# Altium schematic sheet MCU.SchDoc: MCU
size A; Revision: 2.0; SheetNumber: 2; SheetTotal: 3
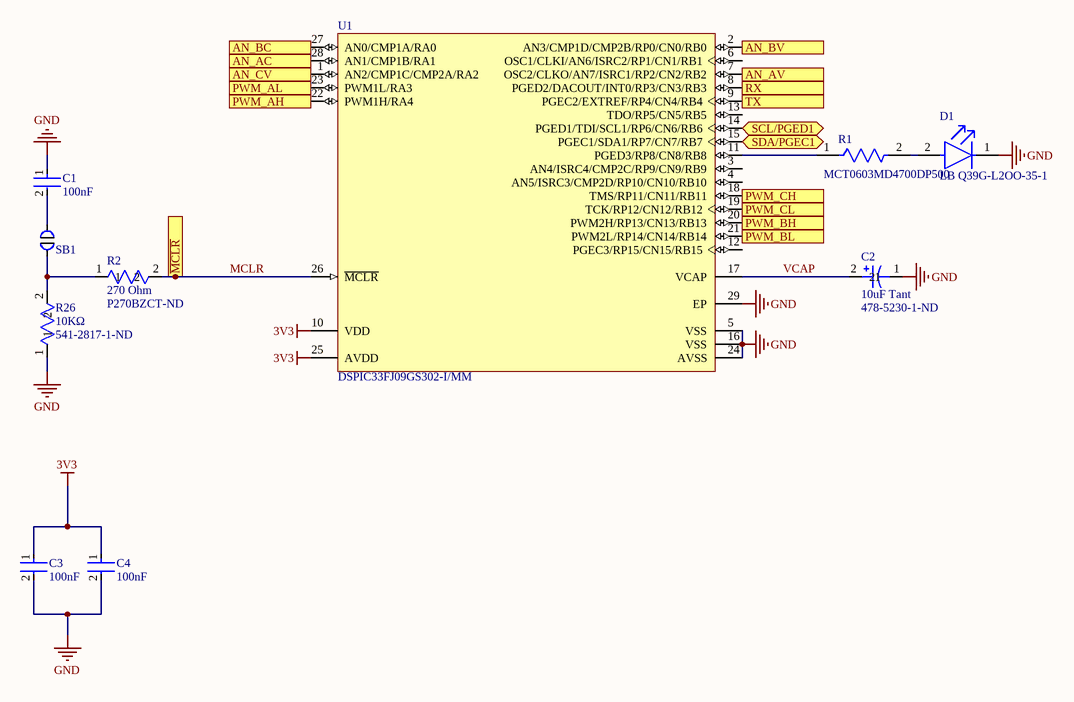
[diagram p0: MCU.SchDoc]

## Parts
C1  100nF  [FP-CL10-IPC_C]
C2  10uF Tant  Supplier Part Number 1: 478-5230-1-ND  [TPSB106K016R0500]
C3  100nF  [FP-CL10-IPC_C]
C4  100nF  [FP-CL10-IPC_C]
D1  LB Q39G-L2OO-35-1  [FP-LB_Q39G-MFG]
R1  MCT0603MD4700DP500  [FP-MCT0603-IPC_A]
R2  270 Ohm  Supplier Part Number 1: P270BZCT-ND  [ERJ-PA3J271V]
R26  10KΩ  Supplier Part Number 1: 541-2817-1-ND  [RCS060310K0JNEA]
SB1  Solder Bridge Open  [Solder Bridge Open]  (value not drawn)
U1  DSPIC33FJ09GS302-I/MM  [MCHP-QFN-S-MM28_M]

## Ports
AN_AC (in), AN_AV (in), AN_BC (in), AN_BV (in), AN_CV (in), PWM_AH (out), PWM_AL (out), PWM_BH (out), PWM_BL (out), PWM_CH (out), PWM_CL (out), RX (in), SCL/PGED1 (bidir), SDA/PGEC1 (bidir), TX (out), ~{MCLR} (in)

## Nets
3V3: C3.1 C4.1 U1.10(VDD) U1.25(AVDD)
GND: C1.1 C2.1 C3.2 C4.2 D1.1(C) R26.1 U1.5(VSS) U1.16(VSS) U1.24(AVSS) U1.29(EP)
AN_AC: U1.28(AN1/CMP1B/RA1) ; port AN_AC
AN_AV: U1.7(OSC2/CLKO/AN7/ISRC1/RP2/CN2/RB2) ; port AN_AV
AN_BC: U1.27(AN0/CMP1A/RA0) ; port AN_BC
AN_BV: U1.2(AN3/CMP1D/CMP2B/RP0/CN0/RB0) ; port AN_BV
AN_CV: U1.1(AN2/CMP1C/CMP2A/RA2) ; port AN_CV
MCLR: R2.2 U1.26(~{MCLR}) ; port ~{MCLR}
PWM_AH: U1.22(PWM1H/RA4) ; port PWM_AH
PWM_AL: U1.23(PWM1L/RA3) ; port PWM_AL
PWM_BH: U1.20(PWM2H/RP13/CN13/RB13) ; port PWM_BH
PWM_BL: U1.21(PWM2L/RP14/CN14/RB14) ; port PWM_BL
PWM_CH: U1.18(TMS/RP11/CN11/RB11) ; port PWM_CH
PWM_CL: U1.19(TCK/RP12/CN12/RB12) ; port PWM_CL
RX: U1.8(PGED2/DACOUT/INT0/RP3/CN3/RB3) ; port RX
SCL/PGED1: U1.14(PGED1/TDI/SCL1/RP6/CN6/RB6) ; port SCL/PGED1
SDA/PGEC1: U1.15(PGEC1/SDA1/RP7/CN7/RB7) ; port SDA/PGEC1
TX: U1.9(PGEC2/EXTREF/RP4/CN4/RB4) ; port TX
VCAP: C2.2 U1.17(VCAP)
NetC1_2: C1.2 SB1.1
NetD1_2: D1.2(A) R1.2
NetR1_1: R1.1 U1.11(PGED3/RP8/CN8/RB8)
NetR2_1: R2.1 R26.2 SB1.2

Not connected (* = marked no-connect by the designer): U1 3(AN4/ISRC4/CMP2C/RP9/CN9/RB9) 4(AN5/ISRC3/CMP2D/RP10/CN10/RB10) 6(OSC1/CLKI/AN6/ISRC2/RP1/CN1/RB1) 12(PGEC3/RP15/CN15/RB15) 13(TDO/RP5/CN5/RB5)

## Notes on the sheet
- Title
- Size:
- Date:
- A
- Number:
- Time:
- Revision:
- Sheet
- of
- File:

## Library data of the parts
C1 C3 C4 = CMP-13271-001724-1: Cap Ceramic 100nF 50V X7R ±20% Pad SMD 0603 +125°C T/R; Mount: Surface Mount; Lead Free: Lead Free; Max Operating Temperature: 125°C; Voltage Rating: 50V; Case Code (Imperial): 0603; Capacitance: 100nF; Height: 0.8mm; Length: 1.6mm; Tolerance: 20%; Case Code (Metric): 1608; Thickness: 0.035inch; Depth: 0.8mm; Width: 0.031inch; Package Quantity: 1; Min Operating Temperature: -55°C; Case/Package: 0603; Radiation Hardening: No; Voltage Rating (DC): 50V; Dielectric: X7R; Packaging: Tape and Reel
C2 = TPSB106K016R0500: CAP TANT 10UF 10% 16V SMD; Manufacturer: Kyocera AVX; Dielectric Material: Tantalum; ESR (Equivalent Series Resistance): 500mR; Leakage Current: 1.6uA; Polarity: Polar; Dissipation Factor: 6%; Supplier 1: Digi-Key; Manufacturer Part Number: TPSB106K016R0500; RoHS: Yes; Category: Tantalum Capacitors; Stock 1: 4; Pricing 1: 1=0.45000, 10=0.31900, 50=0.24140, 100=0.21030, 500=0.15580, 1000=0.13243 (USD); Mount: Surface Mount,PCB; Case/Package: 1210; Case Code (Metric): 3528; Case Code (Imperial): 1210; Min Operating Temperature: -55°C; Max Operating Temperature: 125°C; Capacitance: 10uF; Tolerance: 10%; Packaging: Tape and Reel; Package Quantity: 1; Voltage Rating: 16V; Voltage Rating (DC): 16V; Features: General Purpose; Termination: SMD/SMT; Voltage: 16V; Length: 3.5mm; Width: 0.11inch; Height: 1.9mm; Depth: 2.8mm; Height - Seated (Max): 0.083inch; Radiation Hardening: No; REACH SVHC: No SVHC; Lead Free: Lead Free; ComponentLink1URL: https://datasheet.ciiva.com/11793/0900766b80e0c35e-11793349.pdf?src-supplier=RSComponents; ComponentLink1Description: https://datasheet.ciiva.com/11793/0900766b80e0c35e-11793349.pdf?src-supplier=RSComponents; ComponentLink2URL: https://datasheet.ciiva.com/264/tps-264229.pdf?src-supplier=Digi-Key; ComponentLink2Description: https://datasheet.ciiva.com/264/tps-264229.pdf?src-supplier=Digi-Key; ComponentLink3URL: https://datasheet.ciiva.com/7730/1441576-7730869.pdf?src-supplier=Element14; ComponentLink3Description: https://datasheet.ciiva.com/7730/1441576-7730869.pdf?src-supplier=Element14; ComponentLink4URL: https://datasheet.ciiva.com/17339/tps-17339429.pdf?src-supplier=Avnet+Europe; ComponentLink4Description: https://datasheet.ciiva.com/17339/tps-17339429.pdf?src-supplier=Avnet+Europe; ComponentLink5URL: https://datasheet.ciiva.com/264/tps-264230.pdf?src-supplier=Digi-Key; ComponentLink5Description: https://datasheet.ciiva.com/264/tps-264230.pdf?src-supplier=Digi-Key; ComponentLink6URL: https://datasheet.ciiva.com/7730/1680477-7730870.pdf?src-supplier=Element14; ComponentLink6Description: https://datasheet.ciiva.com/7730/1680477-7730870.pdf?src-supplier=Element14; ComponentLink7URL: https://datasheet.ciiva.com/16500/tps-16500230.pdf?src-supplier=Future+Electronics; ComponentLink7Description: https://datasheet.ciiva.com/16500/tps-16500230.pdf?src-supplier=Future+Electronics; ComponentLink8URL: https://datasheet.ciiva.com/264/tps-264231.pdf?src-supplier=Digi-Key; ComponentLink8Description: https://datasheet.ciiva.com/264/tps-264231.pdf?src-supplier=Digi-Key; ComponentLink9URL: https://datasheet.ciiva.com/7730/1441576-7730871.pdf?src-supplier=Element14; ComponentLink9Description: https://datasheet.ciiva.com/7730/1441576-7730871.pdf?src-supplier=Element14; ComponentLink10URL: https://datasheet.ciiva.com/12882/tps-23028-12882919.pdf?src-supplier=Mouser; ComponentLink10Description: https://datasheet.ciiva.com/12882/tps-23028-12882919.pdf?src-supplier=Mouser; ComponentLink11URL: https://datasheet.ciiva.com/28609/packmark-28609112.pdf?src-supplier=Element14; ComponentLink11Description: https://datasheet.ciiva.com/28609/packmark-28609112.pdf?src-supplier=Element14; ComponentLink12URL: https://datasheet.ciiva.com/14599/70001047-14599898.pdf?src-supplier=Allied+Electronics; ComponentLink12Description: https://datasheet.ciiva.com/14599/70001047-14599898.pdf?src-supplier=Allied+Electronics; ComponentLink13URL: https://datasheet.ciiva.com/14605/70001047-14605902.pdf?src-supplier=Allied+Electronics; ComponentLink13Description: https://datasheet.ciiva.com/14605/70001047-14605902.pdf?src-supplier=Allied+Electronics
D1 = CMP-62016-000036-2: LED BLUE DIFFUSED 0603 SMD; Test Current: 5mA; Dominant Wavelength: 470nm; Number of LEDs: 1; Luminous Flux: 0.07lm; Viewing Angle: 135°; Lens Size: 0.8mm; Luminous Intensity: 29.5mcd; Lens Color: White; Lens Style: Flat; Forward Voltage: 2.85V; Lens Transparency: Diffused; Packaging: Tape and Reel; Case/Package: 0603; Series: CHIPLED 0603; Color: Blue; Height: 0.4mm; Mount: Surface Mount; Length: 1.6mm; Radiation Hardening: No; Case Code (Metric): 1608; Width: 0.8mm; Case Code (Imperial): 0603; Number of Pins: 2
R1 = CMP-02407-005707-1: RES SMD 100 OHM 1% 1/8W 0603; Power Rating: 125mW; Voltage Rating (DC): 75V; Max Power Dissipation: 150mW; Temperature Coefficient: 25ppm/°C; Resistance: 470R; Tolerance: 0.5%; Composition: Thin Film; Max Operating Temperature: 175°C; Termination: SMD/SMT; Case/Package: 0603; Number of Pins: 2; Packaging: Tape and Reel; Width: 0.033inch; REACH SVHC: No SVHC; Case Code (Metric): 1608; Voltage Rating: 75V; Features: Automotive AEC-Q200; Height: 0.022inch; Number of Terminations: 2; Case Code (Imperial): 0603; Package Quantity: 1; Length: 0.061inch; Min Operating Temperature: -55°C
R2 = ERJ-PA3J271V: Res Thick Film 0603 270 Ohm 5% 0.25W(1/4W) ±200ppm/C Pad SMD Automotive T/R; Manufacturer: Panasonic; Resistance: 270R; Max Power Dissipation: 250mW; Temperature Coefficient: 200ppm/°C; Supplier 1: Digi-Key; Manufacturer Part Number: ERJ-PA3J271V; RoHS: Yes; Category: Chip SMD Resistors; Stock 1: 14468; Pricing 1: 1=0.10000, 10=0.08600, 100=0.03300, 1000=0.01452, 2500=0.01254 (USD); Case/Package: 0603; Case Code (Imperial): 0603; Case Code (Metric): 1608; Min Operating Temperature: -55°C; Max Operating Temperature: 155°C; Tolerance: 5%; Features: Automotive AEC-Q200; Packaging: Tape and Reel; Resistor Type: Thick Film; Number of Terminations: 2; Length: 0.063inch; Width: 0.031inch; Height: 0.018inch; ComponentLink1URL: https://industrial.panasonic.com/cdbs/www-data/pdf/RDO0000/AOA0000C331.pdf?src-supplier=Digi-Key; ComponentLink1Description: https://industrial.panasonic.com/cdbs/www-data/pdf/RDO0000/AOA0000C331.pdf?src-supplier=Digi-Key; ComponentLink2URL: https://industrial.panasonic.com/ww/system/files/data/download/catalog/id_fixed-resistors_e_1.pdf?src-supplier=Digi-Key; ComponentLink2Description: https://industrial.panasonic.com/ww/system/files/data/download/catalog/id_fixed-resistors_e_1.pdf?src-supplier=Digi-Key
R26 = RCS060310K0JNEA: RES SMD 10K OHM 5% 1/4W 0603; Manufacturer: Vishay Dale; Max Power Dissipation: 250mW; Temperature Coefficient: 200ppm/°C; Resistance: 10kR; Supplier 1: Digi-Key; Manufacturer Part Number: RCS060310K0JNEA; RoHS: Yes; Category: Chip SMD Resistors; Stock 1: 1896; Pricing 1: 1=0.14000, 10=0.12900, 100=0.04950, 1000=0.02178, 2500=0.01881 (USD); Case/Package: 0603; Case Code (Imperial): 0603; Case Code (Metric): 1608; Min Operating Temperature: -55°C; Max Operating Temperature: 155°C; Tolerance: 5%; Features: Automotive AEC-Q200; Packaging: Tape and Reel; Resistor Type: Thick Film; Number of Terminations: 2; Length: 0.061inch; Width: 0.033inch; Height: 0.02inch; ComponentLink1URL: http://www.vishay.com/docs/20065/rcse3.pdf?src-supplier=Digi-Key; ComponentLink1Description: http://www.vishay.com/docs/20065/rcse3.pdf?src-supplier=Digi-Key
U1 = CMP-0045-00639-1: 16-Bit Microcontroller and Digital Signal Controller with High-Speed PWM, ADC and Comparator, 40 MIPS, 21 I/O, GPIO, -40 to 85 degC, 28-pin QFN (MM28), Tube; Manufacturer: Microchip; DatasheetVersion: Rev. C; ComponentLink2Description: Datasheet; ComponentLink4Description: Product URL; ComponentLink3URL: http://www.microchip.com/stellent/groups/techpub_sg/documents/packagingspec/en012702.pdf; PackageReference: QFN-MM28; Mounting Technology: Surface Mount; PartNumber: DSPIC33FJ09GS302-I/MM; ComponentLink4URL: http://www.microchip.com/dsPIC33FJ09GS302; ComponentLink2URL: http://ww1.microchip.com/downloads/en/DeviceDoc/75018c.pdf; PackageDescription: 28-Lead Plastic Quad Flat, 6 x 6 mm Body, 0.65 mm Pitch; PackageVersion: C04-124C; ComponentLink1Description: Manufacturer URL; ComponentLink3Description: Package Specification; ComponentLink1URL: http://www.microchip.com